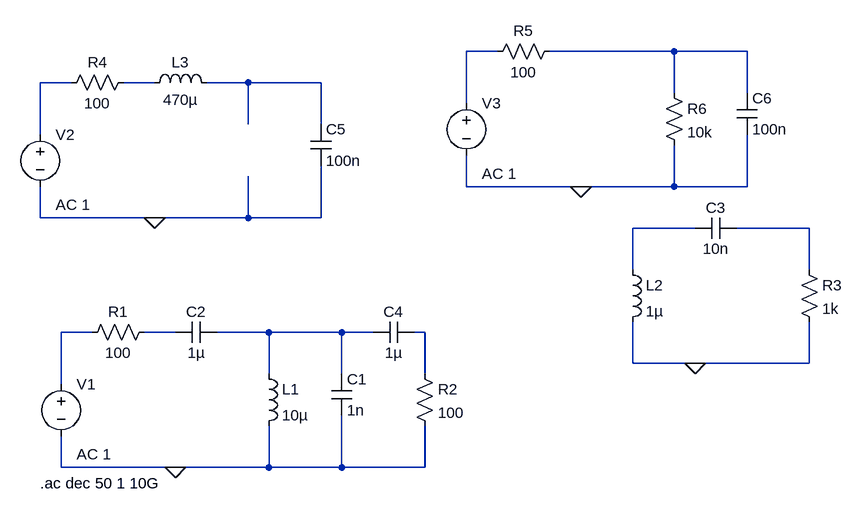
[diagram p0: schematic freq-bpf-slope.asc]
freq-bpf-slope.asc, the LTspice schematic file:
Version 4
SHEET 1 904 680
WIRE 368 -352 320 -352
WIRE 640 -352 448 -352
WIRE 752 -352 640 -352
WIRE -288 -304 -336 -304
WIRE -160 -304 -208 -304
WIRE -16 -304 -80 -304
WIRE 96 -304 -16 -304
WIRE 640 -288 640 -352
WIRE 752 -288 752 -352
WIRE 320 -272 320 -352
WIRE -16 -240 -16 -304
WIRE 96 -240 96 -304
WIRE -336 -224 -336 -304
WIRE 320 -144 320 -192
WIRE 496 -144 320 -144
WIRE 640 -144 640 -208
WIRE 640 -144 496 -144
WIRE 752 -144 752 -224
WIRE 752 -144 640 -144
WIRE -336 -96 -336 -144
WIRE -160 -96 -336 -96
WIRE -16 -96 -16 -160
WIRE -16 -96 -160 -96
WIRE 96 -96 96 -176
WIRE 96 -96 -16 -96
WIRE 672 -80 576 -80
WIRE 848 -80 736 -80
WIRE 576 -16 576 -80
WIRE 848 -16 848 -80
WIRE -256 80 -304 80
WIRE -128 80 -176 80
WIRE 16 80 -64 80
WIRE 128 80 16 80
WIRE 176 80 128 80
WIRE 256 80 240 80
WIRE 576 128 576 64
WIRE 672 128 576 128
WIRE 848 128 848 64
WIRE 848 128 672 128
WIRE 16 144 16 80
WIRE 128 144 128 80
WIRE 256 144 256 80
WIRE -304 160 -304 80
WIRE -304 288 -304 240
WIRE -128 288 -304 288
WIRE 16 288 16 224
WIRE 16 288 -128 288
WIRE 128 288 128 208
WIRE 128 288 16 288
WIRE 256 288 256 224
WIRE 256 288 128 288
FLAG -128 288 0
FLAG 672 128 0
FLAG -160 -96 0
FLAG 496 -144 0
SYMBOL voltage -304 144 R0
WINDOW 123 24 124 Left 2
WINDOW 39 0 0 Left 0
SYMATTR Value2 AC 1
SYMATTR InstName V1
SYMATTR Value ""
SYMBOL ind 0 128 R0
SYMATTR InstName L1
SYMATTR Value 10µ
SYMBOL cap 112 144 R0
SYMATTR InstName C1
SYMATTR Value 1n
SYMBOL res -272 96 R270
WINDOW 0 32 56 VTop 2
WINDOW 3 0 56 VBottom 2
SYMATTR InstName R1
SYMATTR Value 100
SYMBOL ind 560 -32 R0
SYMATTR InstName L2
SYMATTR Value 1µ
SYMBOL cap 736 -96 R90
WINDOW 0 0 32 VBottom 2
WINDOW 3 32 32 VTop 2
SYMATTR InstName C3
SYMATTR Value 10n
SYMBOL res 832 -32 R0
SYMATTR InstName R3
SYMATTR Value 1k
SYMBOL cap -64 64 R90
WINDOW 0 0 32 VBottom 2
WINDOW 3 32 32 VTop 2
SYMATTR InstName C2
SYMATTR Value 1µ
SYMBOL cap 240 64 R90
WINDOW 0 0 32 VBottom 2
WINDOW 3 32 32 VTop 2
SYMATTR InstName C4
SYMATTR Value 1µ
SYMBOL res 240 128 R0
SYMATTR InstName R2
SYMATTR Value 100
SYMBOL voltage -336 -240 R0
WINDOW 123 24 124 Left 2
WINDOW 39 0 0 Left 0
SYMATTR Value2 AC 1
SYMATTR InstName V2
SYMATTR Value ""
SYMBOL ind -176 -288 R270
WINDOW 0 32 56 VTop 2
WINDOW 3 5 56 VBottom 2
SYMATTR InstName L3
SYMATTR Value 470µ
SYMBOL cap 80 -240 R0
SYMATTR InstName C5
SYMATTR Value 100n
SYMBOL res -304 -288 R270
WINDOW 0 32 56 VTop 2
WINDOW 3 0 56 VBottom 2
SYMATTR InstName R4
SYMATTR Value 100
SYMBOL voltage 320 -288 R0
WINDOW 123 24 124 Left 2
WINDOW 39 0 0 Left 0
SYMATTR Value2 AC 1
SYMATTR InstName V3
SYMATTR Value ""
SYMBOL cap 736 -288 R0
SYMATTR InstName C6
SYMATTR Value 100n
SYMBOL res 352 -336 R270
WINDOW 0 32 56 VTop 2
WINDOW 3 0 56 VBottom 2
SYMATTR InstName R5
SYMATTR Value 100
SYMBOL res 624 -304 R0
SYMATTR InstName R6
SYMATTR Value 10k
TEXT -336 312 Left 2 !.ac dec 50 1 10G

The netlist it stands for:
* freq-bpf-slope.asc
V1 N008 0 AC 1
L1 N010 0 10µ
C1 N010 0 1n
R1 N008 N009 100
L2 N006 0 1µ
C3 N007 N006 10n
R3 N007 0 1k
C2 N010 N009 1µ
C4 N011 N010 1µ
R2 N011 0 100
V2 N003 0 AC 1
L3 N004 N005 470µ
C5 N005 0 100n
R4 N003 N004 100
V3 N001 0 AC 1
C6 N002 0 100n
R5 N001 N002 100
R6 N002 0 10k
.ac dec 50 1 10G
.backanno
.end